# EAGLE design PICqueno32_DIP.v1 (EAGLE 5.10)
PROJECT: PICqueño32 DIP v1.0
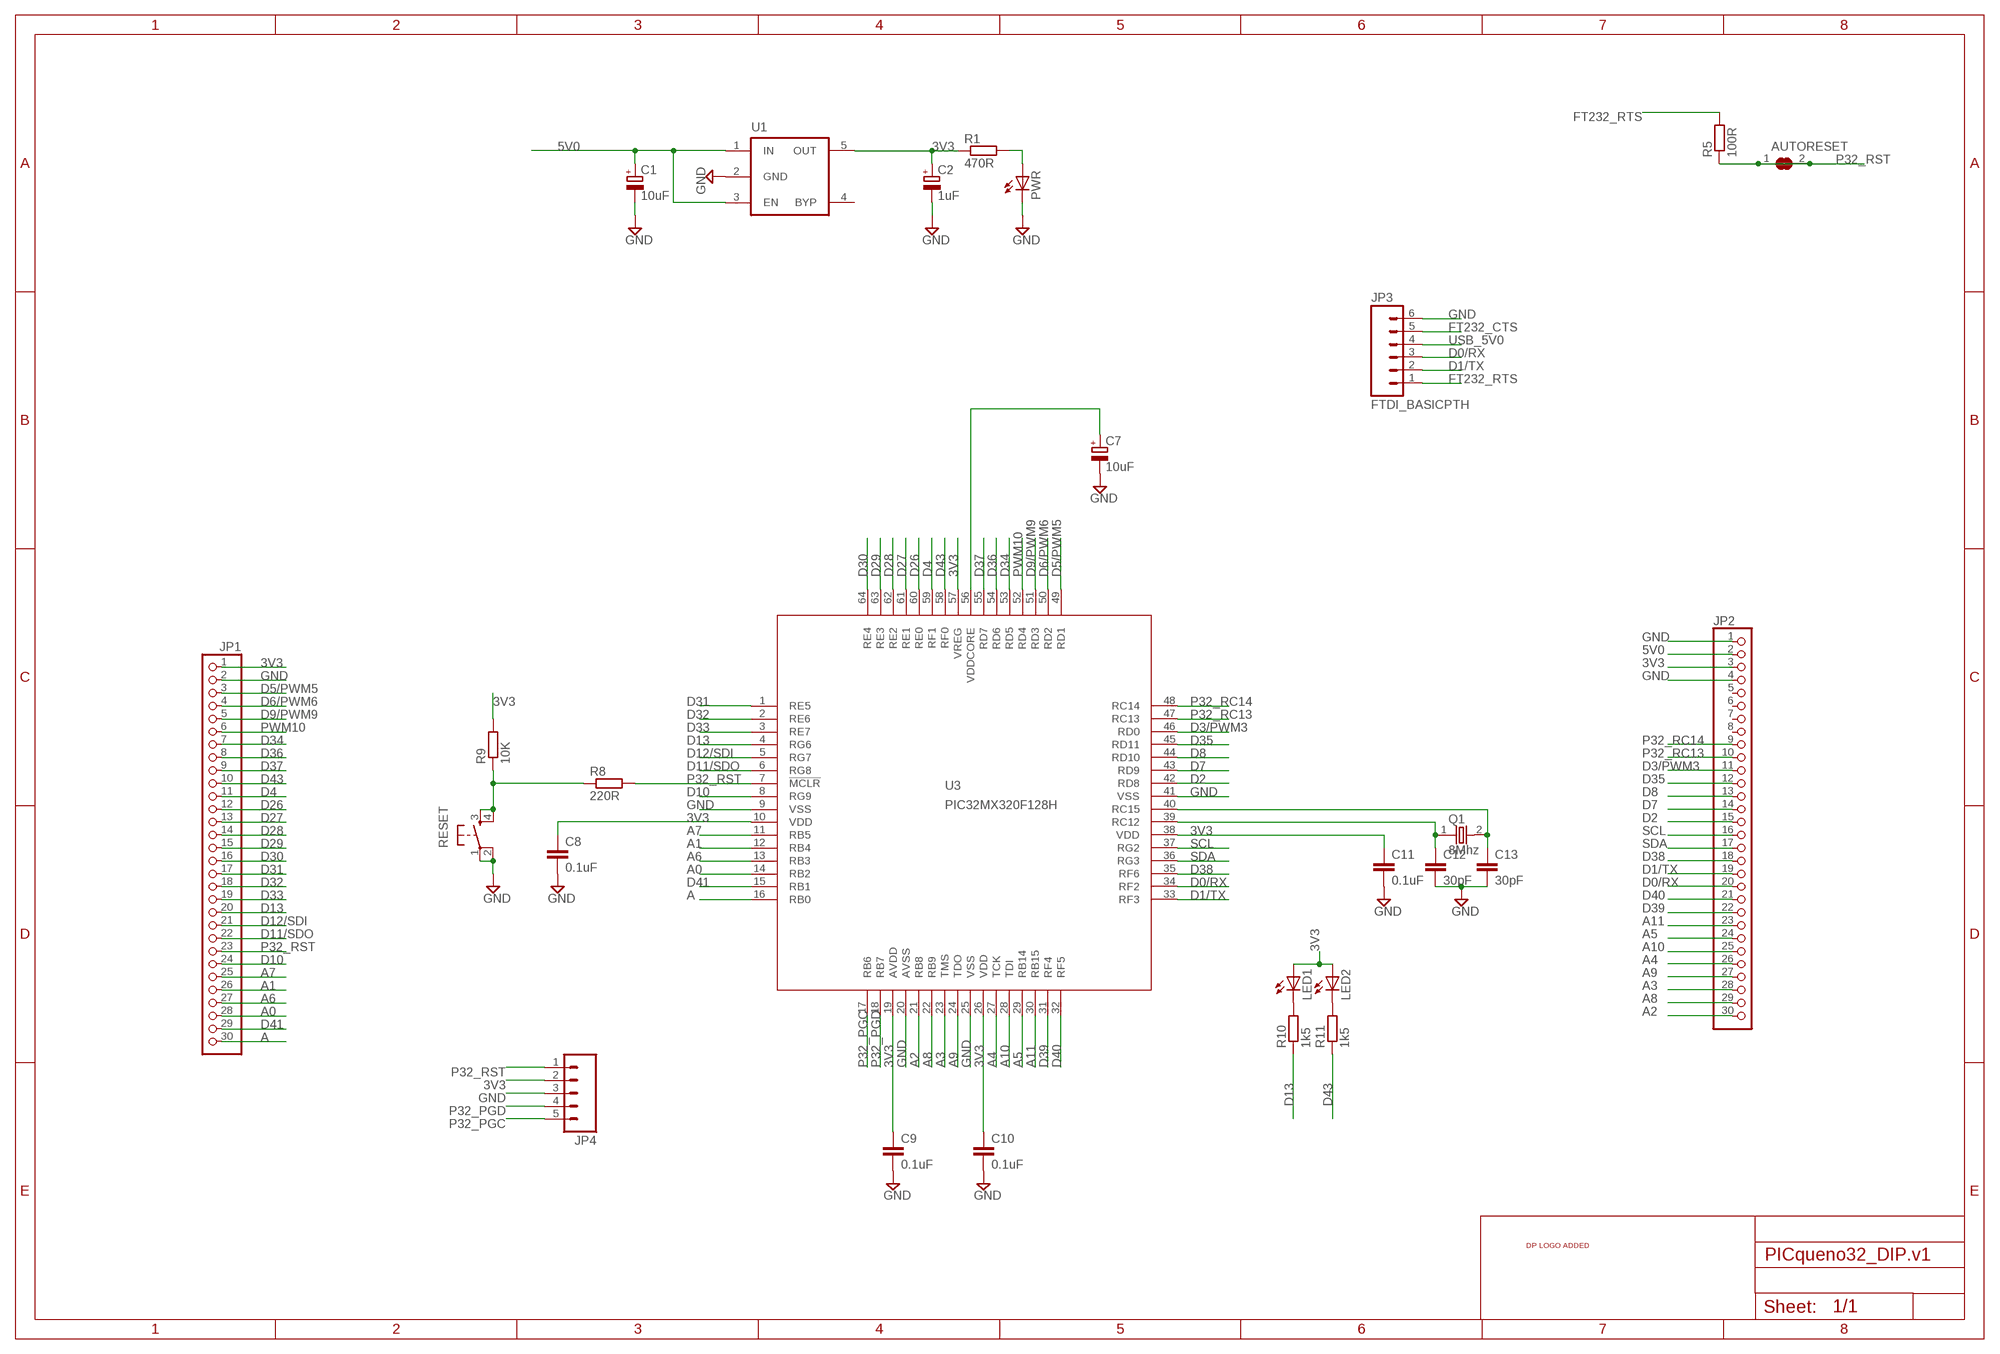
[diagram p0: schematic, sheet 1]

## Parts
AUTORESET  SJ  [SJ]
C1  10uF  CAP_POLSMC_A  [SMC_A]
C2  1uF  CAP_POLSMC_A  [SMC_A]
C7  10uF  CAP_POLSMC_A  [SMC_A]
C8  0.1uF  CAPC603  [C603]
C9  0.1uF  CAPC603  [C603]
C10  0.1uF  CAPC603  [C603]
C11  0.1uF  CAPC603  [C603]
C12  30pF  CAPC603  [C603]
C13  30pF  CAPC603  [C603]
JP1  PINHD-1X30  [1X30]
JP2  PINHD-1X30  [1X30]
JP3  FTDI_BASICPTH  M06LOCK  [1X06_LOCK]
JP4  M05LOCK  [1X05_LOCK]
LED1  LED805  [LED-805]
LED2  LED805  [LED-805]
PWR  LED805  [LED-805]
Q1  8Mhz  OSC-XTAL  [HC-49U]
R1  470R  RESISTORR603  [R603]
R5  100R  RESISTORR603  [R603]
R8  220R  RESISTORR603  [R603]
R9  10K  RESISTORR603  [R603]
R10  1k5  RESISTORR603  [R603]
R11  1k5  RESISTORR603  [R603]
RESET  SW-SMD-SMALL  [TACT_SWITCH_SMALL]
U1  MIC5205  [SOT-23-5]
U3  PIC32MX320F128H  PIC32MX320F064H  [TQFP64-10X10]
U$1  DP_LOGO  [DP_LOGO]

## Nets
3V3: C2.+ C8.1 C9.1 C10.1 C11.1 JP1.1 JP2.3 JP4.2 LED1.A LED2.A R1.1 R9.2 U1.5(OUT) U3.10(VDD) U3.19(AVDD) U3.26(VDD) U3.38(VDD) U3.57(VREG)
5V0: C1.+ JP2.2 U1.1(IN) U1.3(EN)
A: JP1.30 U3.16(RB0)
A0: JP1.28 U3.14(RB2)
A1: JP1.26 U3.12(RB4)
A2: JP2.30 U3.21(RB8)
A3: JP2.28 U3.23(TMS)
A4: JP2.26 U3.27(TCK)
A5: JP2.24 U3.29(RB14)
A6: JP1.27 U3.13(RB3)
A7: JP1.25 U3.11(RB5)
A8: JP2.29 U3.22(RB9)
A9: JP2.27 U3.24(TDO)
A10: JP2.25 U3.28(TDI)
A11: JP2.23 U3.30(RB15)
D0/RX: JP2.20 JP3.3 U3.34(RF2)
D1/TX: JP2.19 JP3.2 U3.33(RF3)
D2: JP2.15 U3.42(RD8)
D3/PWM3: JP2.11 U3.46(RD0)
D4: JP1.11 U3.59(RF1)
D5/PWM5: JP1.3 U3.49(RD1)
D6/PWM6: JP1.4 U3.50(RD2)
D7: JP2.14 U3.43(RD9)
D8: JP2.13 U3.44(RD10)
D9/PWM9: JP1.5 U3.51(RD3)
D10: JP1.24 U3.8(RG9)
D11/SDO: JP1.22 U3.6(RG8)
D12/SDI: JP1.21 U3.5(RG7)
D13: JP1.20 R10.1 U3.4(RG6)
D26: JP1.12 U3.60(RE0)
D27: JP1.13 U3.61(RE1)
D28: JP1.14 U3.62(RE2)
D29: JP1.15 U3.63(RE3)
D30: JP1.16 U3.64(RE4)
D31: JP1.17 U3.1(RE5)
D32: JP1.18 U3.2(RE6)
D33: JP1.19 U3.3(RE7)
D34: JP1.7 U3.53(RD5)
D35: JP2.12 U3.45(RD11)
D36: JP1.8 U3.54(RD6)
D37: JP1.9 U3.55(RD7)
D38: JP2.18 U3.35(RF6)
D39: JP2.22 U3.31(RF4)
D40: JP2.21 U3.32(RF5)
D41: JP1.29 U3.15(RB1)
D43: JP1.10 R11.1 U3.58(RF0)
FT232_CTS: JP3.5
FT232_RTS: JP3.1 R5.2
GND: C1.- C2.- C7.- C8.2 C9.2 C10.2 C11.2 C12.2 C13.2 JP1.2 JP2.1 JP2.4 JP3.6 JP4.3 PWR.C RESET.1 RESET.2 U1.2(GND) U3.9(VSS) U3.20(AVSS) U3.25(VSS) U3.41(VSS)
N$5: C7.+ U3.56(VDDCORE)
N$8: LED1.C R10.2
N$9: LED2.C R11.2
N$15: PWR.A R1.2
N$16: R8.1 R9.1 RESET.3 RESET.4
N$19: C12.1 Q1.1 U3.39(RC12)
N$20: C13.1 Q1.2 U3.40(RC15)
P32_PGC: JP4.5 U3.17(RB6)
P32_PGD: JP4.4 U3.18(RB7)
P32_RC13: JP2.10 U3.47(RC13)
P32_RC14: JP2.9 U3.48(RC14)
P32_RST: AUTORESET.1 AUTORESET.2 JP1.23 JP4.1 R5.1 R8.2 U3.7(!MCLR)
PWM10: JP1.6 U3.52(RD4)
SCL: JP2.16 U3.37(RG2)
SDA: JP2.17 U3.36(RG3)
USB_5V0: JP3.4
Unconnected: JP2.5 JP2.6 JP2.7 JP2.8 U1.4(BYP)

## Library data of the parts
AUTORESET = jumper:SJ: SMD solder JUMPER
C1 C2 C7 = dp_devices:CAP_POL
C8-C13 = dp_devices:CAP
JP1 JP2 = pinhead:PINHD-1X30: PIN HEADER
JP3 = SparkFun:M06: Header 6 Standard 6-pin 0.1" header. Use with straight break away headers (SKU : PRT-00116), right angle break away headers (PRT-00553), swiss pins (PRT-00743), machine pins (PRT-00117), and female headers (PRT-00115). Molex polarized connector foot print use with SKU : PRT-08094 with associated crimp pins and housings. NOTES ON THE VARIANTS LOCK and LOCK_LONGPADS... This footprint was designed to help hold the alignment of a through-hole component (i.e. 6-pin header) while soldering it into place. You may notice that each hole has been shifted either up or down by 0.005 of an inch from it's more standard position (which is a perfectly straight line). This slight alteration caused the pins (the squares in the middle) to touch the edges of the holes. Because they are alternating, it causes a "brace" to hold the component in place. 0.005 has proven to be the perfect amount of "off-center" position when using our standard breakaway headers. Although looks a little odd when you look at the bare footprint, once you have a header in there, the alteration is very hard to notice. Also, if you push a header all the way into place, it is covered up entirely on the bottom side. This idea of altering the position of holes to aid alignment will be further integrated into the Sparkfun Library for other footprints. It can help hold any component with 3 or more connection pins.
JP4 = SparkFun:M05: Header 5 Standard 5-pin 0.1" header. Use with straight break away headers (SKU : PRT-00116), right angle break away headers (PRT-00553), swiss pins (PRT-00743), machine pins (PRT-00117), and female headers (PRT-00115). Molex polarized connector foot print use with SKU : PRT-08230 with associated crimp pins and housings.
LED1 LED2 PWR = dp_devices:LED
Q1 = dp_devices:OSC-XTAL
R1 R5 R8-R11 = dp_devices:RESISTOR
RESET = dp_devices:SW-SMD-SMALL
U1 = dp_devices:MIC5205: 150ma Low-Noise LDO Regulator
U3 = microchip:PIC32MX320F*H: PIC32MX320FxxxH Source: http://ww1.microchip.com/downloads/en/DeviceDoc/61143E.pdf, PIC32MX320F064H.bsdl; MPN: PIC32MX320F064H-80I/PT; OC_FARNELL: 1778934; OC_NEWARK: 77M3147
U$1 = dp_devices:DP_LOGO; FF1: fullfillment by; FF2: Seeed studio; FF3: www.seeedstudio.com; LICENSE: CC-BY-SA; PROJECT: project; URL1: http://; URL2: DangerousPrototypes.com

## Board
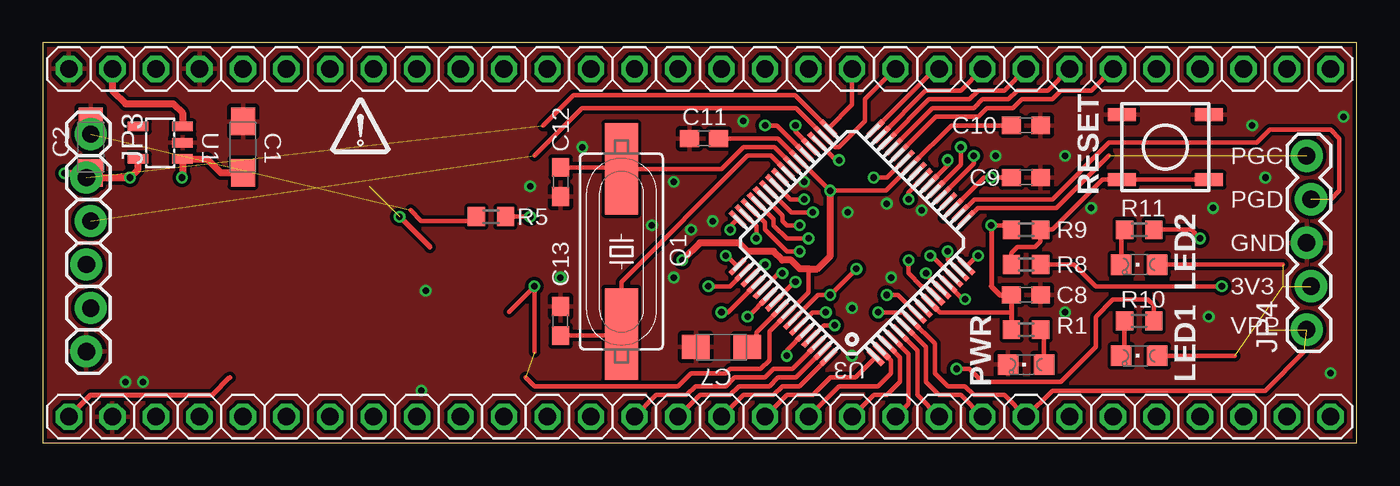
[diagram p1: board, top side]
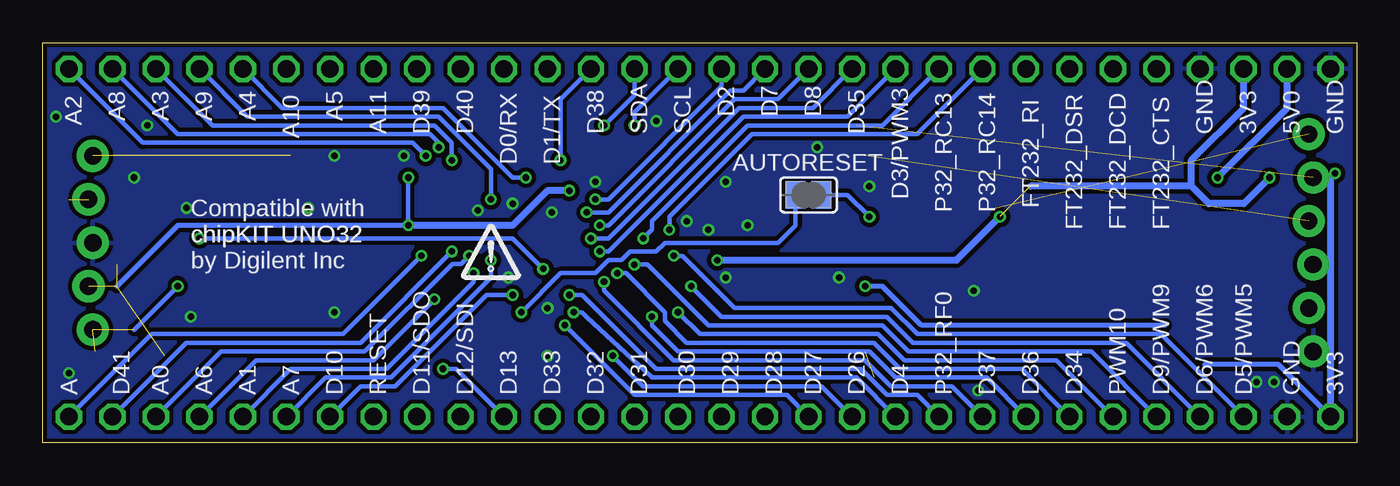
[diagram p2: board, bottom side, seen from below]

Size 76.71 x 23.37 mm. Coordinates in mm from the lower left corner, seen from the top.
Outline: 0,0 76.71,0 76.71,23.37 0,23.37 0,0
Copper layers (1*16): Top 0.035mm / dielectric 1.5mm / Bottom 0.035mm
Design rules "Fusion_eagle_rule_v1.1": minimum track width 6mil, minimum drill 12mil, track to track 6mil, track to pad 6mil, pad to pad 6mil, via to via 6mil, smd to smd 0mil, copper to edge 10mil, drill to drill 10mil, minimum pad ring 10mil, minimum via ring 6mil, stop-mask expansion 2mil, vias tented up to drill 100mil, thermal gap 10mil

### Footprints (pad centres in the part's own frame; a part is rotated, then mirrored left to right if it is on the bottom)
SJ = smd 1.168 x 1.6: 1 -0.762,0; 2 0.762,0
SMC_A = smd 1.6 x 1.4: + -1.5,0; - 1.5,0
C603 = smd 1.1 x 1: 1 -0.85,0; 2 0.85,0
1X30 = drill 1.016 octagon: 1 -36.83,0; 2 -34.29,0; 3 -31.75,0; 4 -29.21,0; 5 -26.67,0; 6 -24.13,0; 7 -21.59,0; 8 -19.05,0; 9 -16.51,0; 10 -13.97,0; 11 -11.43,0; 12 -8.89,0; 13 -6.35,0; 14 -3.81,0; 15 -1.27,0; 16 1.27,0; 17 3.81,0; 18 6.35,0; 19 8.89,0; 20 11.43,0; 21 13.97,0; 22 16.51,0; 23 19.05,0; 24 21.59,0; 25 24.13,0; 26 26.67,0; 27 29.21,0; 28 31.75,0; 29 34.29,0; 30 36.83,0
1X06_LOCK = drill 1.016 pad 1.88 round: 1 0,0; 2 2.54,-0.254; 3 5.08,0; 4 7.62,-0.254; 5 10.16,0; 6 12.7,-0.254
1X05_LOCK = drill 1.016 pad 1.88 round: 1 0,0.127; 2 2.54,-0.127; 3 5.08,0.127; 4 7.62,-0.127; 5 10.16,0.127
LED-805 = smd 1.2 x 1.2: A 0,-1.05; C 0,1.05
HC-49U = smd 5.334 x 1.93: 1 -4.826,0; 2 4.826,0
R603 = smd 1 x 1.1: 1 -0.85,0; 2 0.85,0
TACT_SWITCH_SMALL = smd 1.651 x 0.762: 1 -2.54,1.905; 2 2.54,1.905; 3 -2.54,-1.905; 4 2.54,-1.905
SOT-23-5 = smd 0.55 x 1.2: 1 -0.95,-1.3; 2 0,-1.3; 3 0.95,-1.3; 4 0.95,1.3; 5 -0.95,1.3
TQFP64-10X10 = smd 1.2 x 0.3: 1 -5.7,3.75; 2 -5.7,3.25; 3 -5.7,2.75; 4 -5.7,2.25; 5 -5.7,1.75; 6 -5.7,1.25; 7 -5.7,0.75; 8 -5.7,0.25; 9 -5.7,-0.25; 10 -5.7,-0.75; 11 -5.7,-1.25; 12 -5.7,-1.75; 13 -5.7,-2.25; 14 -5.7,-2.75; 15 -5.7,-3.25; 16 -5.7,-3.75; 33 5.7,-3.75; 34 5.7,-3.25; 35 5.7,-2.75; 36 5.7,-2.25; 37 5.7,-1.75; 38 5.7,-1.25; 39 5.7,-0.75; 40 5.7,-0.25; 41 5.7,0.25; 42 5.7,0.75; 43 5.7,1.25; 44 5.7,1.75; 45 5.7,2.25; 46 5.7,2.75; 47 5.7,3.25; 48 5.7,3.75 | smd 0.3 x 1.2: 17 -3.75,-5.7; 18 -3.25,-5.7; 19 -2.75,-5.7; 20 -2.25,-5.7; 21 -1.75,-5.7; 22 -1.25,-5.7; 23 -0.75,-5.7; 24 -0.25,-5.7; 25 0.25,-5.7; 26 0.75,-5.7; 27 1.25,-5.7; 28 1.75,-5.7; 29 2.25,-5.7; 30 2.75,-5.7; 31 3.25,-5.7; 32 3.75,-5.7; 49 3.75,5.7; 50 3.25,5.7; 51 2.75,5.7; 52 2.25,5.7; 53 1.75,5.7; 54 1.25,5.7; 55 0.75,5.7; 56 0.25,5.7; 57 -0.25,5.7; 58 -0.75,5.7; 59 -1.25,5.7; 60 -1.75,5.7; 61 -2.25,5.7; 62 -2.75,5.7; 63 -3.25,5.7; 64 -3.75,5.7

### Placement (x,y rotation side)
AUTORESET  32,14.48 0 bottom
C1  11.68,17.27 90 top
C2  2.79,17.27 90 top
C7  39.62,5.59 180 top
C8  57.4,8.64 0 top
C9  57.4,15.49 0 top
C10  57.4,18.54 0 top
C11  38.61,17.78 180 top
C12  30.23,15.24 270 top
C13  30.23,7.11 90 top
JP1  38.35,1.52 0 top
JP2  38.35,21.84 0 top
JP3  2.79,18.03 270 top
JP4  73.91,6.6 90 top
LED1  64.01,5.08 90 top
LED2  64.01,10.41 90 top
PWR  57.4,4.57 90 top
Q1  33.78,11.18 270 top
R1  57.4,6.6 0 top
R5  26.16,13.21 180 top
R8  57.4,10.41 0 top
R9  57.4,12.45 180 top
R10  64.01,7.11 180 top
R11  64.01,12.45 180 top
RESET  65.53,17.27 0 top
U1  6.86,17.53 90 top
U3  47.24,11.68 135 top
U$1  50.55,10.16 0 bottom
U$2  [DP_LOGO]  18.54,17.53 0 top

### Tracks (layer width: path | path; a pad name or v marks a point on that pad's centre or on a via)
3V3  (via drill 0.38)  (5 unrouted)
  Top 0.254: C11.1 42.92,17.78 U3.38 v45.96,14.73 v45.97,14.73 49.23,14.73 U3.26 53.04,18.54 C10.1 | 28.19,3.81 28.7,3.3 37.08,3.3 37.85,4.06 39.88,4.06 40.13,4.32 41.91,4.32 42.42,4.83 42.42,6.5 U3.57 44.7,8.79 44.7,10.16 | 28.7,5.3 v28.7,9.14 27.21,7.65 | 52.58,13.13 U3.19 54.94,15.49 v55.37,15.49 C9.1 | LED2.A 72.39,10.41 | LED1.A 69.6,5.08 | U3.10 52.37,7.62 56.55,7.62 | R9.2 56.3,12.7 v55.37,12.7
  Top 0.305: 10.92,3.81 9.91,2.79 2.79,2.79 JP1.1 | R1.1 56.55,7.62 C8.1 55.88,8.64 55.37,9.14 v55.37,12.7 | 20.82,13.22 v20.83,13.21 22.61,11.43
  Top 0.406: v1.27,15.75 2.29,15.75 | 2.29,15.75 2.77,15.75 C2.+ | U1.5 5.56,15.97 v5.08,15.49 2.54,15.49 2.29,15.75 | v37.34,10.67 38.35,11.68 40.64,11.68 41.15,11.18 42.67,11.18 43.18,10.67 43.69,10.67 44.2,10.16 44.7,10.16 45.21,10.16 45.97,10.92 v45.97,14.73
  Bottom 0.254: v55.37,12.7 v55.37,15.49
  Bottom 0.305: 72.39,9.14 68.83,12.7 v55.37,12.7 | v28.7,9.14 27.69,9.14 25.4,6.86 11.18,6.86 | 8.89,4.57 4.57,4.57 JP1.1
  Bottom 0.406: JP1.1 1.52,15.49 v1.27,15.75 1.29,15.77 | JP2.3 6.6,19.56 9.65,16.51 9.65,14.99 | v45.97,14.73 47.24,14.73 49.28,12.7 v55.37,12.7 | 9.65,14.99 8.64,13.97 6.6,13.97 v5.08,15.49 | 9.65,14.99 19.05,14.99 | v37.34,10.67 23.37,10.67 v20.83,13.21
5V0  (via drill 0.38)
  Top 0.406: C1.+ 10.39,15.77 9.59,16.58 U1.1 8.16,15.52 v8.13,15.49 | JP2.2 4.06,20.57 4.83,19.81 7.62,19.81 8.16,19.27 U1.3
  Bottom 0.406: v8.13,15.49 4.06,19.56 JP2.2
A  (via drill 0.38)
  Top 0.254: U3.16 54.54,10.92 v54.61,10.92
  Bottom 0.254: v54.61,10.92 59.18,6.35 70.36,6.35 JP1.30
A0  (via drill 0.38)
  Top 0.254: U3.14 51.9,10.92 v51.82,10.92
  Bottom 0.254: JP1.28 66.29,5.33 57.91,5.33 52.79,10.45 52.28,10.45 v51.82,10.92
A1  (via drill 0.38)
  Top 0.254: U3.12 51.56,9.84 v51.56,9.91
  Bottom 0.254: v51.56,9.91 51.56,9.4 56.64,4.32 62.23,4.32 JP1.26
A2  (via drill 0.38)
  Top 0.254: U3.21 54.36,16.32 v54.36,16.76
  Bottom 0.254: v54.36,16.76 55.12,17.53 70.87,17.53 JP2.30
A3  (via drill 0.38)
  Top 0.254: U3.23 52.88,16.26 v52.83,16.51
  Bottom 0.254: JP2.28 66.8,18.54 53.85,18.54 52.83,17.53 v52.83,16.51
A4  (via drill 0.38)
  Top 0.254: U3.27 49.29,15.49 v48.51,15.49
  Bottom 0.254: v48.51,15.49 49.28,15.49 53.34,19.56 62.74,19.56 JP2.26
A5
  Top 0.254: U3.29 51.94,19.56 54.36,19.56 54.86,20.07 56.39,20.07 56.9,20.57 58.67,20.57 JP2.24
A6  (via drill 0.38)
  Top 0.254: U3.13 53.73,8.38 v53.85,8.38
  Bottom 0.254: JP1.27 64.26,4.83 57.4,4.83 v53.85,8.38
A7  (via drill 0.38)
  Top 0.254: v50.55,10.67 50.55,9.91 51.31,9.14 51.55,9.14 U3.11
  Bottom 0.254: v50.55,10.67 50.55,9.65 56.39,3.81 60.2,3.81 JP1.25
A8  (via drill 0.38)
  Top 0.254: U3.22 53.59,16.27 v53.59,17.27
  Bottom 0.254: JP2.29 68.83,18.03 54.1,18.03 53.59,17.53 v53.59,17.27
A9  (via drill 0.38)
  Top 0.254: 50.9,14.99 U3.24 50.55,14.63 v50.55,14.22
  Bottom 0.254: JP2.27 64.77,19.05 53.59,19.05 50.55,16 v50.55,14.22
A10
  Top 0.254: U3.28 52.14,19.05 54.61,19.05 55.12,19.56 56.64,19.56 57.15,20.07 58.93,20.07 59.44,20.57 61.21,20.57 JP2.25
A11
  Top 0.254: U3.30 51.74,20.07 54.1,20.07 54.61,20.57 56.13,20.57 JP2.23
D0/RX  (1 unrouted)
  Top 0.254: 28.7,16.76 31.5,19.56 43.97,19.56 U3.34 46.25,17.27 46.48,17.27 48.01,18.8 48.01,20.07 JP2.20
D1/TX  (1 unrouted)
  Top 0.254: 29.21,18.54 30.99,20.32 43.91,20.32 U3.33 47.24,19.74 JP2.19
D2  (via drill 0.38)
  Top 0.254: U3.42 43.64,14.22 v44.45,14.22
  Bottom 0.254: v44.45,14.22 43.69,14.22 37.08,20.83 JP2.15
D3/PWM3  (via drill 0.38)
  Top 0.254: U3.46 42.16,12.88 42.16,12.45 43.43,11.18 v44.2,11.18
  Bottom 0.254: JP2.11 29.72,19.05 35.81,19.05 43.69,11.18 v44.2,11.18
D4  (via drill 0.38)
  Top 0.254: U3.59 44.95,7.62 v45.72,7.62
  Bottom 0.254: v45.72,7.62 45.21,7.62 44.96,7.37 41.15,3.81 29.21,3.81 JP1.11
D5/PWM5  (via drill 0.38)
  Top 0.254: U3.49 39.95,10.92 v39.88,10.92
  Bottom 0.254: v39.88,10.92 39.37,10.92 36.32,7.87 27.18,7.87 25.65,6.35 11.43,6.35 JP1.3
D6/PWM6  (via drill 0.38)
  Top 0.254: U3.50 40.11,9.14 v38.86,9.14
  Bottom 0.254: v38.86,9.14 37.08,7.37 27.43,7.37 25.91,5.84 13.46,5.84 JP1.4
D7  (via drill 0.38)
  Top 0.254: U3.43 43.7,13.46 v44.96,13.46
  Bottom 0.254: JP2.14 35.81,20.57 36.58,20.57 43.69,13.46 v44.96,13.46
D8  (via drill 0.38)
  Top 0.254: U3.44 43.18,13.27 43.18,12.95 43.43,12.7 v44.2,12.7
  Bottom 0.254: JP2.13 33.78,20.07 36.32,20.07 43.69,12.7 v44.2,12.7
D9/PWM9  (via drill 0.38)
  Top 0.254: U3.51 42.09,10.41 v42.16,10.41
  Bottom 0.254: v42.16,10.41 41.4,10.41 37.85,6.86 27.69,6.86 26.16,5.33 15.49,5.33 JP1.5
D10  (via drill 0.38)
  Top 0.254: U3.8 49.94,8.64 v49.28,8.64
  Bottom 0.254: v49.28,8.64 50.8,8.64 56.13,3.3 58.17,3.3 JP1.24
D11/SDO
  Top 0.254: U3.6 51.56,5.6 51.56,3.56 52.32,2.79 53.59,2.79 JP1.22
D12/SDI
  Top 0.254: U3.5 51.05,5.4 51.05,2.79 JP1.21
D13  (via drill 0.38)
  Top 0.254: U3.4 50.55,5.2 50.55,2.29 JP1.20 | R10.1 64.86,8.04 64.52,8.38 62.48,8.38 61.47,7.37 61.47,5.59 59.44,3.56 54.86,3.56 54.1,4.32 v53.34,4.32
  Bottom 0.254: JP1.20 52.58,4.32 v53.34,4.32
D26  (via drill 0.38)
  Top 0.254: U3.60 43.43,5.4 v43.43,5.08
  Bottom 0.254: v43.43,5.08 41.66,3.3 31.24,3.3 JP1.12
D27  (via drill 0.38)
  Top 0.254: U3.61 45.6,6.86 v46.23,6.86
  Bottom 0.254: v46.23,6.86 42.16,2.79 33.27,2.79 JP1.13
D28
  Top 0.254: U3.62 43.77,4.32 42.67,4.32 42.16,3.81 40.39,3.81 39.88,3.3 38.1,3.3 37.59,2.79 35.81,2.79 JP1.14
D29
  Top 0.254: U3.63 43.97,3.81 42.93,3.81 42.42,3.3 40.64,3.3 40.13,2.79 38.35,2.79 JP1.15
D30
  Top 0.254: U3.64 44.16,3.3 43.18,3.3 42.67,2.79 40.89,2.79 JP1.16
D31
  Top 0.254: U3.1 47.43,3.81 45.97,3.81 44.96,2.79 43.43,2.79 JP1.17
D32
  Top 0.254: U3.2 49.53,4.8 49.53,4.06 48.77,3.3 46.48,3.3 JP1.18
D33
  Top 0.254: U3.3 50.04,5 50.04,3.56 49.28,2.79 48.51,2.79 JP1.19
D34  (via drill 0.38)
  Top 0.254: U3.53 42.99,9.91 v43.18,9.91
  Bottom 0.254: v43.18,9.91 42.67,9.91 40.39,7.62 40.39,7.11 39.12,5.84 28.19,5.84 26.67,4.32 19.56,4.32 JP1.7
D35  (via drill 0.38)
  Top 0.254: U3.45 42.67,13.07 42.67,12.7 43.43,11.94 v44.7,11.94
  Bottom 0.254: v44.7,11.94 43.69,11.94 36.07,19.56 31.75,19.56 JP2.12
D36  (via drill 0.38)
  Top 0.254: U3.54 41.16,7.37 v41.15,7.37
  Bottom 0.254: v41.15,7.37 41.15,6.86 39.62,5.33 28.45,5.33 26.92,3.81 21.59,3.81 JP1.8
D37  (via drill 0.38)
  Top 0.254: U3.55 43.9,9.4 v43.94,9.4
  Bottom 0.254: v43.94,9.4 43.94,8.89 39.88,4.83 28.7,4.83 27.18,3.3 23.62,3.3 JP1.9
D38  (via drill 0.38)
  Top 0.254: U3.35 46.31,16.51 v46.48,16.51
  Bottom 0.254: v46.48,16.51 46.48,20.07 JP2.18
D39
  Top 0.254: U3.31 51.54,20.57 53.59,20.57 JP2.22
D40
  Top 0.254: U3.32 52.1,21.84 JP2.21
D41  (via drill 0.38)
  Top 0.254: U3.15 52.83,10.69 v52.83,11.18
  Bottom 0.254: v52.83,11.18 58.17,5.84 68.33,5.84 JP1.29
D43  (via drill 0.38)
  Top 0.254: U3.58 45.26,8.64 v45.97,8.64 v47.5,10.16 | R11.1 67.06,12.45 v67.56,11.94
  Bottom 0.254: JP1.10 25.65,2.79 27.43,2.79 28.96,4.32 40.89,4.32 45.21,8.64 v45.97,8.64 | v67.56,11.94 49.28,11.94 v47.5,10.16
FT232_RTS  (1 unrouted)
  Top 0.254: 21.47,13.59 22.1,12.95 25.06,12.95 R5.2
GND  (via drill 0.38)
  other vias: 22.35,8.89 4.83,3.56 5.84,3.56 55.63,16.76 59.69,16.76 39.12,12.95 37.85,12.45 28.45,14.99 30.23,9.65 36.83,15.24 35.56,12.7 36.83,9.65 31.5,17.27 40.89,18.8 44.45,15.24 47.24,5.08 47.24,7.87 46.99,13.46 51.31,13.59 49.28,13.97 59.69,7.62 71.37,15.49 61.21,13.72 75.95,19.05 75.18,4.06 22.1,3.05 49.53,9.65 70.61,18.54 68.33,13.72 68.07,7.37
  pour Top (isolate 0.203): 0,0 76.71,0 76.71,23.37 0,23.37
  pour Bottom (isolate 0.254): 0,0 76.71,0 76.71,23.37 0,23.37
N$5
  Top 0.254: U3.56 41.66,6.45 41.66,6.1 41.15,5.59 C7.+
N$8
  Top 0.254: R10.2 63.16,5.28 LED1.C
N$9
  Top 0.254: LED2.C 62.96,12.25 R11.2
N$15
  Top 0.254: PWR.A 58.45,6.4 R1.2
N$16
  Top 0.254: R8.1 56.55,11.09 56.9,11.43 57.91,11.43 58.25,11.77 R9.1 58.93,12.45 61.85,15.37 RESET.3 RESET.4
N$19
  Top 0.254: U3.39 42.72,17.27 40.89,17.27 39.62,16 Q1.1 33.69,16.09 C12.1
N$20
  Top 0.254: U3.40 42.52,16.76 41.15,16.76 33.78,9.4 Q1.2 33.69,6.26 C13.1
P32_PGC  (1 unrouted)
  Top 0.254: U3.17 54.58,13.72 59.18,13.72 62.23,16.76
P32_PGD  (1 unrouted)
  Top 0.254: 75.18,14.22 75.69,14.73 75.69,17.78 75.18,18.29 71.63,18.29 70.87,17.53 62.23,17.53 58.93,14.22 54.38,14.22 U3.18
P32_RC13  (via drill 0.38)
  Top 0.254: U3.47 41.66,12.68 v41.66,11.94
  Bottom 0.254: v41.66,11.94 41.15,12.45 41.15,12.95 35.56,18.54 27.69,18.54 JP2.10
P32_RC14  (via drill 0.38)
  Top 0.254: U3.48 40.13,12.63 v40.13,12.45
  Bottom 0.254: JP2.9 25.4,18.29 25.65,18.03 35.31,18.03 40.13,13.21 v40.13,12.45
P32_RST  (via drill 0.38)  (2 unrouted)
  Top 0.254: R5.1 v28.45,13.21 | v48.77,7.62 50.25,7.62 U3.7 52.07,5.8 52.07,4.06 52.83,3.3 53.85,3.3 54.36,2.79 56.13,2.79 JP1.23 58.93,3.05 71.37,3.05 73.66,5.33 | R8.2 60.2,10.41 61.47,9.14 v68.83,9.14
  Bottom 0.152: AUTORESET.2 AUTORESET.1
  Bottom 0.254: v48.77,7.62 46.48,9.91 44.45,9.91 43.69,10.67 42.93,10.67 42.42,11.18 40.89,11.18 40.39,11.68 33.78,11.68 32.77,12.7 AUTORESET.1 | v68.83,9.14 71.37,6.6 | AUTORESET.2 29.72,14.48 v28.45,13.21
PWM10  (via drill 0.38)
  Top 0.254: U3.52 40,7.62 v39.62,7.62
  Bottom 0.254: v39.62,7.62 38.35,6.35 27.94,6.35 26.42,4.83 17.53,4.83 JP1.6
SCL  (via drill 0.38)
  Top 0.254: U3.37 42.86,18.54 v42.16,18.54
  Bottom 0.254: JP2.16 42.16,19.3 v42.16,18.54
SDA  (via drill 0.38)
  Top 0.254: U3.36 43.94,18.17 v43.94,18.54
  Bottom 0.254: v43.94,18.54 42.16,20.32 JP2.17

### Text on the board
tNames: PGC | PGD | GND | 3V3 | VPP
bNames: D8 | D7 | D2 | A5 | A4 | A9 | A3 | A8 | A2 | GND | 5V0 | 3V3 | GND | D35 | SCL | SDA | D38 | D40 | D39 | A11 | A10 | D1/TX | D0/RX | FT232_RI | D3/PWM3 | P32_RC14 | P32_RC13 | Compatible with | FT232_CTS | FT232_DCD | FT232_DSR | chipKIT UNO32 | chipKIT UNO32 | by Digilent Inc | 3V3 | GND | D5/PWM5 | D6/PWM6 | D9/PWM9 | PWM10 | D34 | D36 | D37 | P32_RF0 | D4 | D26 | D27 | D28 | D29 | D30 | D31 | D32 | D33 | D13 | D12/SDI | D11/SDO | RESET | D10 | A7 | A1 | A6 | A0 | D41 | A